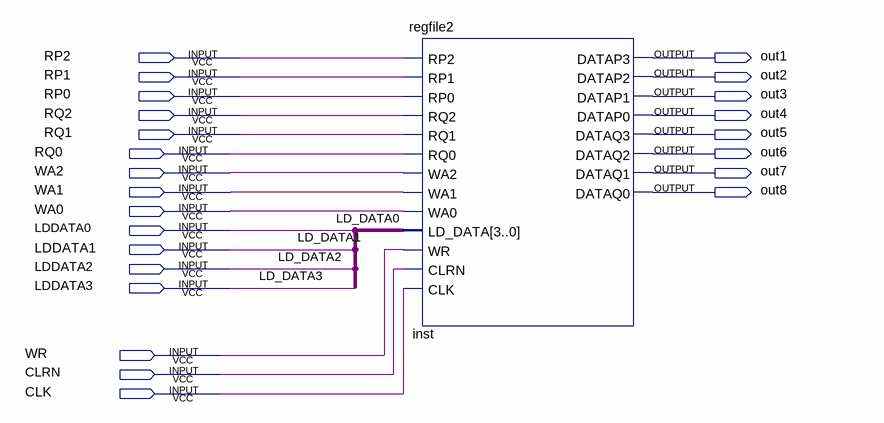
[diagram p0: schematic sheet]
// Quartus schematic QUESTION4.bdf as structural Verilog: 1 symbols, 24 pins
module QUESTION4 (
  input  RP2,
  input  RP1,
  input  RP0,
  input  RQ2,
  input  RQ1,
  input  RQ0,
  input  WA2,
  input  WA1,
  input  WA0,
  input  LDDATA0,
  input  LDDATA1,
  input  LDDATA2,
  input  LDDATA3,
  input  WR,
  input  CLRN,
  input  CLK,
  output out1,
  output out2,
  output out3,
  output out4,
  output out5,
  output out6,
  output out7,
  output out8
);

  wire [3:0] undriven;

  regfile2 inst (
    .RP2(RP2), .RP1(RP1), .RP0(RP0), .RQ2(RQ2), .RQ1(RQ1), .RQ0(RQ0), .WA2(WA2), .WA1(WA1), .WA0(WA0),
    .LD_DATA(undriven), .WR(WR), .CLRN(CLRN), .CLK(CLK), .DATAP3(out1), .DATAP2(out2), .DATAP1(out3),
    .DATAP0(out4), .DATAQ3(out5), .DATAQ2(out6), .DATAQ1(out7), .DATAQ0(out8));

  // Other names for the same wires on the sheet: LD_DATA0 = LDDATA0; LD_DATA1 = LDDATA1; LD_DATA2 = LDDATA2;
  //   LD_DATA3 = LDDATA3
endmodule
